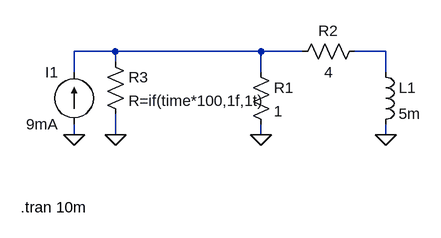
[diagram p0: schematic 8-31.asc]
8-31.asc, the LTspice schematic file:
Version 4
SHEET 1 880 680
WIRE 176 80 112 80
WIRE 400 80 176 80
WIRE 464 80 400 80
WIRE 592 80 544 80
WIRE 176 96 176 80
WIRE 112 112 112 80
WIRE 400 112 400 80
WIRE 592 112 592 80
WIRE 112 208 112 192
WIRE 176 208 176 176
WIRE 400 208 400 192
WIRE 592 208 592 192
FLAG 112 208 0
FLAG 176 208 0
FLAG 592 208 0
FLAG 400 208 0
SYMBOL current 112 192 R180
WINDOW 0 24 80 Left 2
WINDOW 3 24 0 Left 2
WINDOW 123 0 0 Left 2
WINDOW 39 0 0 Left 2
SYMATTR InstName I1
SYMATTR Value 9mA
SYMBOL res 384 96 R0
SYMATTR InstName R1
SYMATTR Value 1
SYMBOL res 448 96 R270
WINDOW 0 32 56 VTop 2
WINDOW 3 0 56 VBottom 2
SYMATTR InstName R2
SYMATTR Value 4
SYMBOL ind 576 96 R0
SYMATTR InstName L1
SYMATTR Value 5m
SYMBOL res 160 80 R0
SYMATTR InstName R3
SYMATTR Value R=if(time*100,1f,1t)
TEXT 30 320 Left 2 !.tran 10m

The netlist it stands for:
* 8-31.asc
I1 0 N001 9mA
R1 N001 0 1
R2 N001 N002 4
L1 N002 0 5m
R3 N001 0 R=if(time*100,1f,1t)
.tran 10m
.backanno
.end